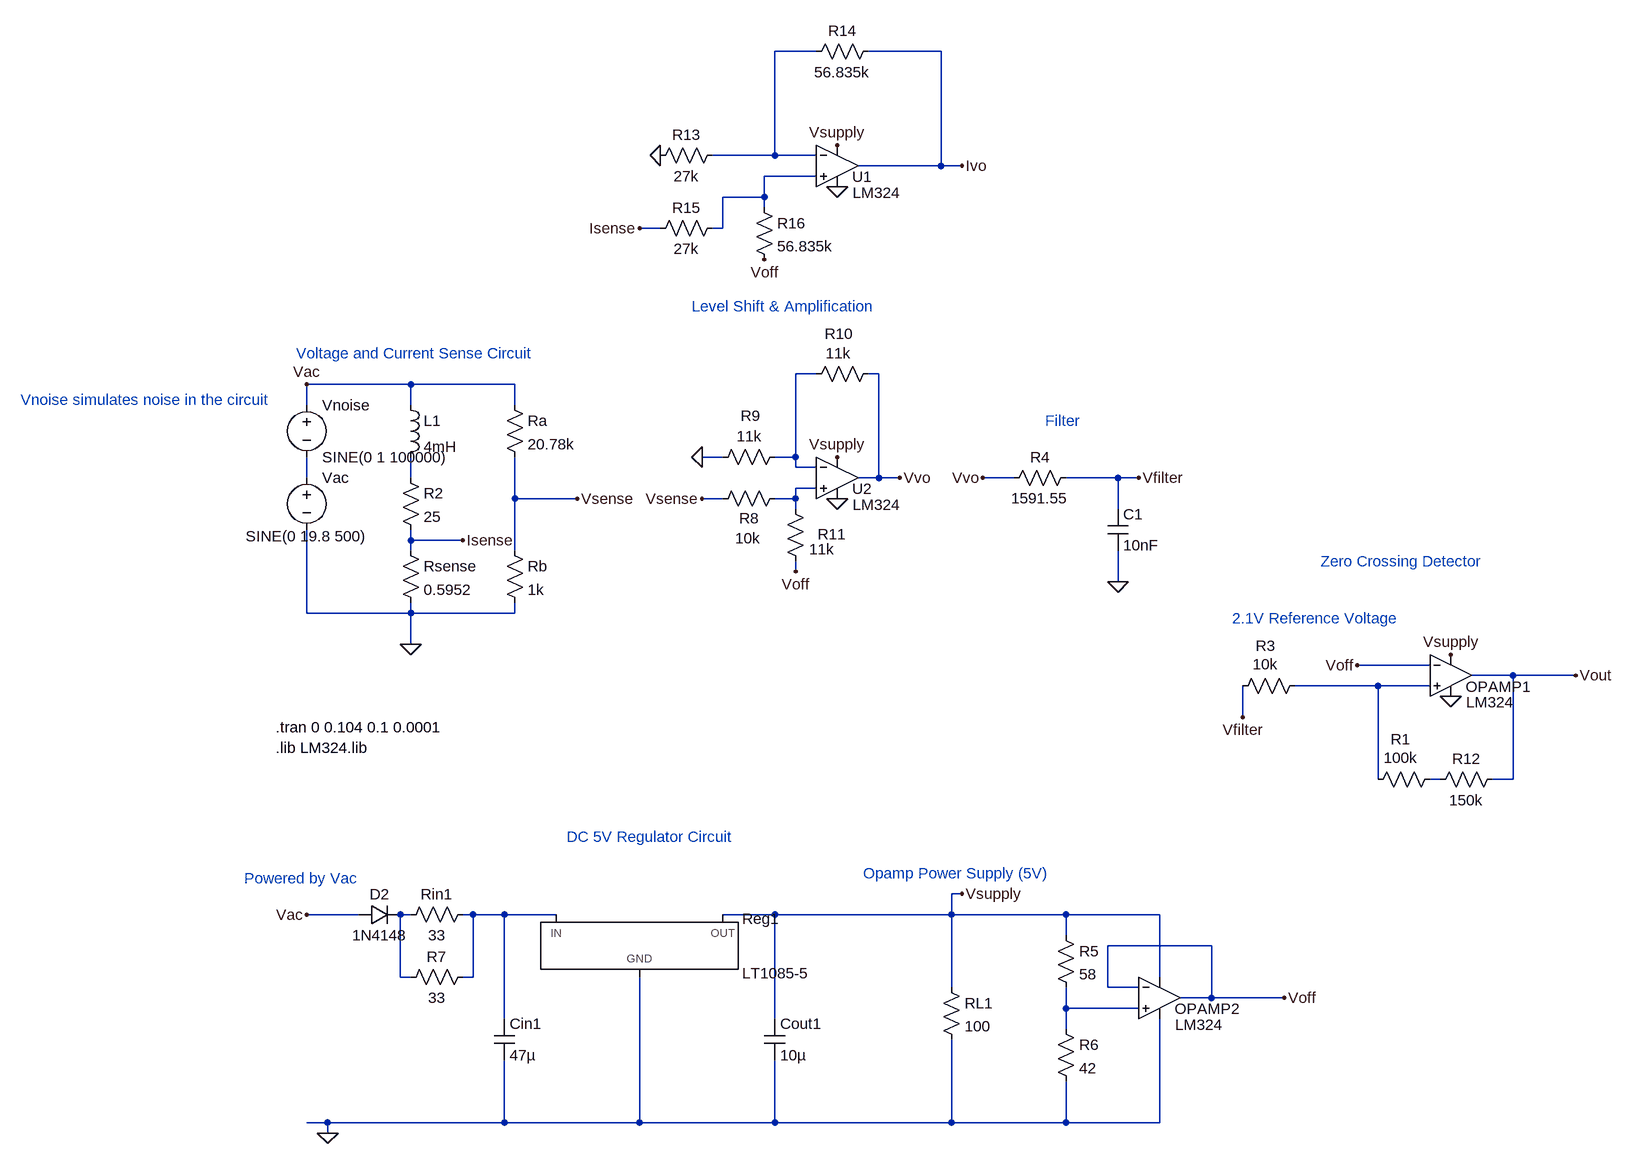
[diagram p0: schematic LTSpice implementation(With current sensor).asc]
LTSpice implementation(With current sensor).asc, the LTspice schematic file:
Version 4
SHEET 1 1880 1172
WIRE 640 -560 576 -560
WIRE 832 -560 720 -560
WIRE 576 -400 576 -560
WIRE 576 -400 480 -400
WIRE 640 -400 576 -400
WIRE 832 -384 832 -560
WIRE 832 -384 704 -384
WIRE 864 -384 832 -384
WIRE 640 -368 560 -368
WIRE 560 -336 560 -368
WIRE 560 -336 496 -336
WIRE 560 -320 560 -336
WIRE 400 -288 368 -288
WIRE 496 -288 496 -336
WIRE 496 -288 480 -288
WIRE 640 -64 608 -64
WIRE 736 -64 720 -64
WIRE 16 -48 -144 -48
WIRE 176 -48 16 -48
WIRE -144 -16 -144 -48
WIRE 16 -16 16 -48
WIRE 176 -16 176 -48
WIRE 496 64 464 64
WIRE 608 64 608 -64
WIRE 608 64 576 64
WIRE 608 80 608 64
WIRE 640 80 608 80
WIRE -144 96 -144 64
WIRE 16 96 16 64
WIRE 736 96 736 -64
WIRE 736 96 704 96
WIRE 768 96 736 96
WIRE 944 96 896 96
WIRE 1104 96 1024 96
WIRE 1136 96 1104 96
WIRE 640 112 608 112
WIRE 176 128 176 64
WIRE 272 128 176 128
WIRE 496 128 464 128
WIRE 608 128 608 112
WIRE 608 128 576 128
WIRE 608 144 608 128
WIRE 1104 144 1104 96
WIRE 16 192 16 176
WIRE 96 192 16 192
WIRE 16 208 16 192
WIRE 176 208 176 128
WIRE 608 240 608 224
WIRE 1104 256 1104 208
WIRE -144 304 -144 176
WIRE 16 304 16 288
WIRE 16 304 -144 304
WIRE 176 304 176 288
WIRE 176 304 16 304
WIRE 16 352 16 304
WIRE 1584 384 1472 384
WIRE 1712 400 1648 400
WIRE 1808 400 1712 400
WIRE 1504 416 1376 416
WIRE 1584 416 1504 416
WIRE 1296 464 1296 416
WIRE 1504 560 1504 416
WIRE 1600 560 1584 560
WIRE 1712 560 1712 400
WIRE 1712 560 1680 560
WIRE 864 736 848 736
WIRE -64 768 -144 768
WIRE 16 768 0 768
WIRE 112 768 96 768
WIRE 160 768 112 768
WIRE 240 768 160 768
WIRE 576 768 496 768
WIRE 848 768 848 736
WIRE 848 768 576 768
WIRE 1024 768 848 768
WIRE 1168 768 1024 768
WIRE 1024 800 1024 768
WIRE 1248 816 1088 816
WIRE 0 864 0 768
WIRE 16 864 0 864
WIRE 112 864 112 768
WIRE 112 864 96 864
WIRE 1168 864 1168 768
WIRE 848 880 848 768
WIRE 1088 880 1088 816
WIRE 1136 880 1088 880
WIRE 1248 896 1248 816
WIRE 1248 896 1200 896
WIRE 1360 896 1248 896
WIRE 1024 912 1024 880
WIRE 1136 912 1024 912
WIRE 160 928 160 768
WIRE 576 928 576 768
WIRE 1024 944 1024 912
WIRE -112 1088 -144 1088
WIRE 160 1088 160 992
WIRE 160 1088 -112 1088
WIRE 368 1088 368 864
WIRE 368 1088 160 1088
WIRE 576 1088 576 992
WIRE 576 1088 368 1088
WIRE 848 1088 848 960
WIRE 848 1088 576 1088
WIRE 1024 1088 1024 1024
WIRE 1024 1088 848 1088
WIRE 1168 1088 1168 928
WIRE 1168 1088 1024 1088
WIRE -112 1104 -112 1088
FLAG 16 352 0
FLAG 1104 256 0
FLAG -144 -48 Vac
FLAG -112 1104 0
FLAG -144 768 Vac
FLAG 864 736 Vsupply
FLAG 672 128 0
FLAG 672 64 Vsupply
FLAG 464 128 Vsense
FLAG 464 64 0
FLAG 768 96 Vvo
FLAG 608 240 Voff
FLAG 896 96 Vvo
FLAG 272 128 Vsense
FLAG 1616 432 0
FLAG 1808 400 Vout
FLAG 1472 384 Voff
FLAG 1616 368 Vsupply
FLAG 1296 464 Vfilter
FLAG 1136 96 Vfilter
FLAG 96 192 Isense
FLAG 560 -240 Voff
FLAG 400 -400 0
FLAG 672 -352 0
FLAG 672 -416 Vsupply
FLAG 368 -288 Isense
FLAG 864 -384 Ivo
FLAG 1360 896 Voff
SYMBOL res 160 -32 R0
SYMATTR InstName Ra
SYMATTR Value 20.78k
SYMBOL ind 0 -32 R0
SYMATTR InstName L1
SYMATTR Value 4mH
SYMBOL res 0 80 R0
SYMATTR InstName R2
SYMATTR Value 25
SYMBOL res 0 192 R0
SYMATTR InstName Rsense
SYMATTR Value 0.5952
SYMBOL voltage -144 80 R0
WINDOW 3 -94 106 Left 2
WINDOW 123 0 0 Left 0
WINDOW 39 0 0 Left 0
SYMATTR Value SINE(0 19.8 500)
SYMATTR InstName Vac
SYMBOL res 160 192 R0
SYMATTR InstName Rb
SYMATTR Value 1k
SYMBOL res 1040 80 R90
WINDOW 0 0 56 VBottom 2
WINDOW 3 32 56 VTop 2
SYMATTR InstName R4
SYMATTR Value 1591.55
SYMBOL cap 1088 144 R0
SYMATTR InstName C1
SYMATTR Value 10nF
SYMBOL PowerProducts/LT1085-5 368 768 R0
SYMATTR InstName Reg1
SYMBOL res 832 864 R0
SYMATTR InstName RL1
SYMATTR Value 100
SYMBOL res 112 752 R90
WINDOW 0 0 56 VBottom 2
WINDOW 3 32 56 VTop 2
SYMATTR InstName Rin1
SYMATTR Value 33
SYMBOL diode -64 784 R270
WINDOW 0 32 32 VTop 2
WINDOW 3 0 32 VBottom 2
SYMATTR InstName D2
SYMATTR Value 1N4148
SYMBOL cap 144 928 R0
SYMATTR InstName Cin1
SYMATTR Value 47µ
SYMATTR SpiceLine Rser=0.001
SYMBOL cap 560 928 R0
SYMATTR InstName Cout1
SYMATTR Value 10µ
SYMATTR SpiceLine Rser=0.001
SYMBOL res 1008 784 R0
SYMATTR InstName R5
SYMATTR Value 58
SYMBOL res 1008 928 R0
SYMATTR InstName R6
SYMATTR Value 42
SYMBOL res 112 848 R90
WINDOW 0 0 56 VBottom 2
WINDOW 3 32 56 VTop 2
SYMATTR InstName R7
SYMATTR Value 33
SYMBOL Opamps/opamp2 672 32 R0
WINDOW 0 23 81 Left 2
WINDOW 3 24 105 Left 2
SYMATTR InstName U2
SYMATTR Value LM324
SYMBOL res 592 112 R90
WINDOW 0 62 55 VBottom 2
WINDOW 3 61 57 VTop 2
SYMATTR InstName R8
SYMATTR Value 10k
SYMBOL res 592 48 R90
WINDOW 0 -32 53 VBottom 2
WINDOW 3 -32 55 VTop 2
SYMATTR InstName R9
SYMATTR Value 11k
SYMBOL res 736 -80 R90
WINDOW 0 -30 61 VBottom 2
WINDOW 3 -31 62 VTop 2
SYMATTR InstName R10
SYMATTR Value 11k
SYMBOL res 624 240 R180
WINDOW 0 -62 57 Left 2
WINDOW 3 -44 34 Left 2
SYMATTR InstName R11
SYMATTR Value 11k
SYMBOL voltage -144 -32 R0
WINDOW 123 0 0 Left 0
WINDOW 39 0 0 Left 0
SYMATTR InstName Vnoise
SYMATTR Value SINE(0 1 100000)
SYMBOL Opamps/opamp2 1616 336 R0
WINDOW 0 23 81 Left 2
WINDOW 3 24 105 Left 2
SYMATTR InstName OPAMP1
SYMATTR Value LM324
SYMBOL res 1600 544 R90
WINDOW 0 -30 61 VBottom 2
WINDOW 3 -2 61 VBottom 2
SYMATTR InstName R1
SYMATTR Value 100k
SYMBOL res 1392 400 R90
WINDOW 0 -30 61 VBottom 2
WINDOW 3 -2 61 VBottom 2
SYMATTR InstName R3
SYMATTR Value 10k
SYMBOL res 1696 544 R90
WINDOW 0 0 56 VBottom 2
WINDOW 3 32 56 VTop 2
SYMATTR InstName R12
SYMATTR Value 150k
SYMBOL Opamps/opamp2 672 -448 R0
WINDOW 0 23 81 Left 2
WINDOW 3 24 105 Left 2
SYMATTR InstName U1
SYMATTR Value LM324
SYMBOL res 496 -416 R90
WINDOW 0 0 56 VBottom 2
WINDOW 3 32 56 VTop 2
SYMATTR InstName R13
SYMATTR Value 27k
SYMBOL res 384 -272 R270
WINDOW 0 32 56 VTop 2
WINDOW 3 0 56 VBottom 2
SYMATTR InstName R15
SYMATTR Value 27k
SYMBOL res 736 -576 R90
WINDOW 0 0 56 VBottom 2
WINDOW 3 32 56 VTop 2
SYMATTR InstName R14
SYMATTR Value 56.835k
SYMBOL res 544 -336 R0
SYMATTR InstName R16
SYMATTR Value 56.835k
SYMBOL Opamps/opamp2 1168 832 R0
WINDOW 0 23 81 Left 2
WINDOW 3 24 105 Left 2
SYMATTR InstName OPAMP2
SYMATTR Value LM324
TEXT -160 -96 Left 2 ;Voltage and Current Sense Circuit
TEXT 448 -168 Left 2 ;Level Shift & Amplification
TEXT 256 648 Left 2 ;DC 5V Regulator Circuit
TEXT 712 704 Left 2 ;Opamp Power Supply (5V)
TEXT -240 712 Left 2 ;Powered by Vac
TEXT 992 8 Left 2 ;Filter
TEXT -192 480 Left 2 !.tran 0 0.104 0.1 0.0001\n.lib LM324.lib
TEXT 1416 224 Left 2 ;Zero Crossing Detector
TEXT 1280 312 Left 2 ;2.1V Reference Voltage
TEXT -584 -24 Left 2 ;Vnoise simulates noise in the circuit

The netlist it stands for:
* LTSpice implementation(With current sensor).asc
Ra Vac Vsense 20.78k
L1 Vac N005 4mH
R2 N005 Isense 25
Rsense Isense 0 0.5952
Vac N004 0 SINE(0 19.8 500)
Rb Vsense 0 1k
R4 Vfilter Vvo 1591.55
C1 Vfilter 0 10nF
XReg1 0 Vsupply N010 LT1085-5  ; pins GND OUT IN
RL1 Vsupply 0 100
Rin1 N010 N009 33
D2 Vac N009 1N4148
Cin1 N010 0 47µ Rser=0.001
Cout1 Vsupply 0 10µ Rser=0.001
R5 Vsupply N011 58
R6 N011 0 42
R7 N010 N009 33
XU2 N006 N003 Vsupply 0 Vvo LM324  ; pins In+ In- V+ V- OUT
R8 N006 Vsense 10k
R9 N003 0 11k
R10 Vvo N003 11k
R11 Voff N006 11k
Vnoise Vac N004 SINE(0 1 100000)
XOPAMP1 N007 Voff Vsupply 0 Vout LM324  ; pins In+ In- V+ V- OUT
R1 N008 N007 100k
R3 N007 Vfilter 10k
R12 Vout N008 150k
XU1 N002 N001 Vsupply 0 Ivo LM324  ; pins In+ In- V+ V- OUT
R13 N001 0 27k
R15 Isense N002 27k
R14 Ivo N001 56.835k
R16 N002 Voff 56.835k
XOPAMP2 N011 Voff Vsupply 0 Voff LM324  ; pins In+ In- V+ V- OUT
.model D D
.lib standard.dio
* Voltage and Current Sense Circuit
* Level Shift & Amplification
* DC 5V Regulator Circuit
* Opamp Power Supply (5V)
* Powered by Vac
* Filter
.tran 0 0.104 0.1 0.0001
.lib LM324.lib
* Zero Crossing Detector
* 2.1V Reference Voltage
* Vnoise simulates noise in the circuit
.backanno
.end